# EasyEDA Pro project ProProject_EquiCycle_2024-03-26.epro, board PCB1
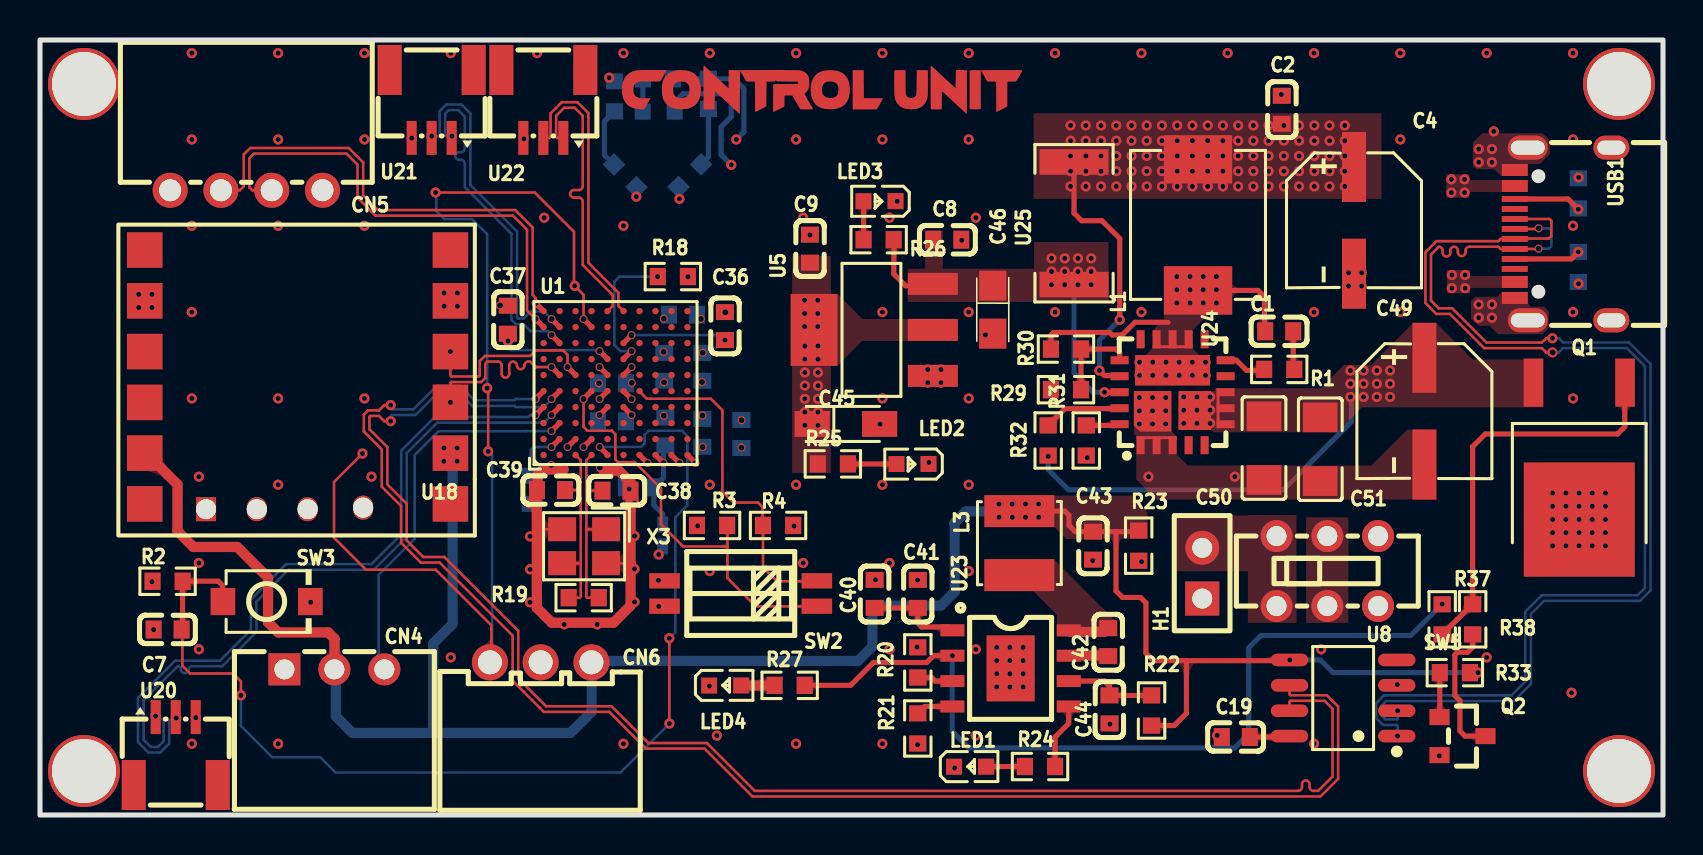
[diagram p1: board, top side]
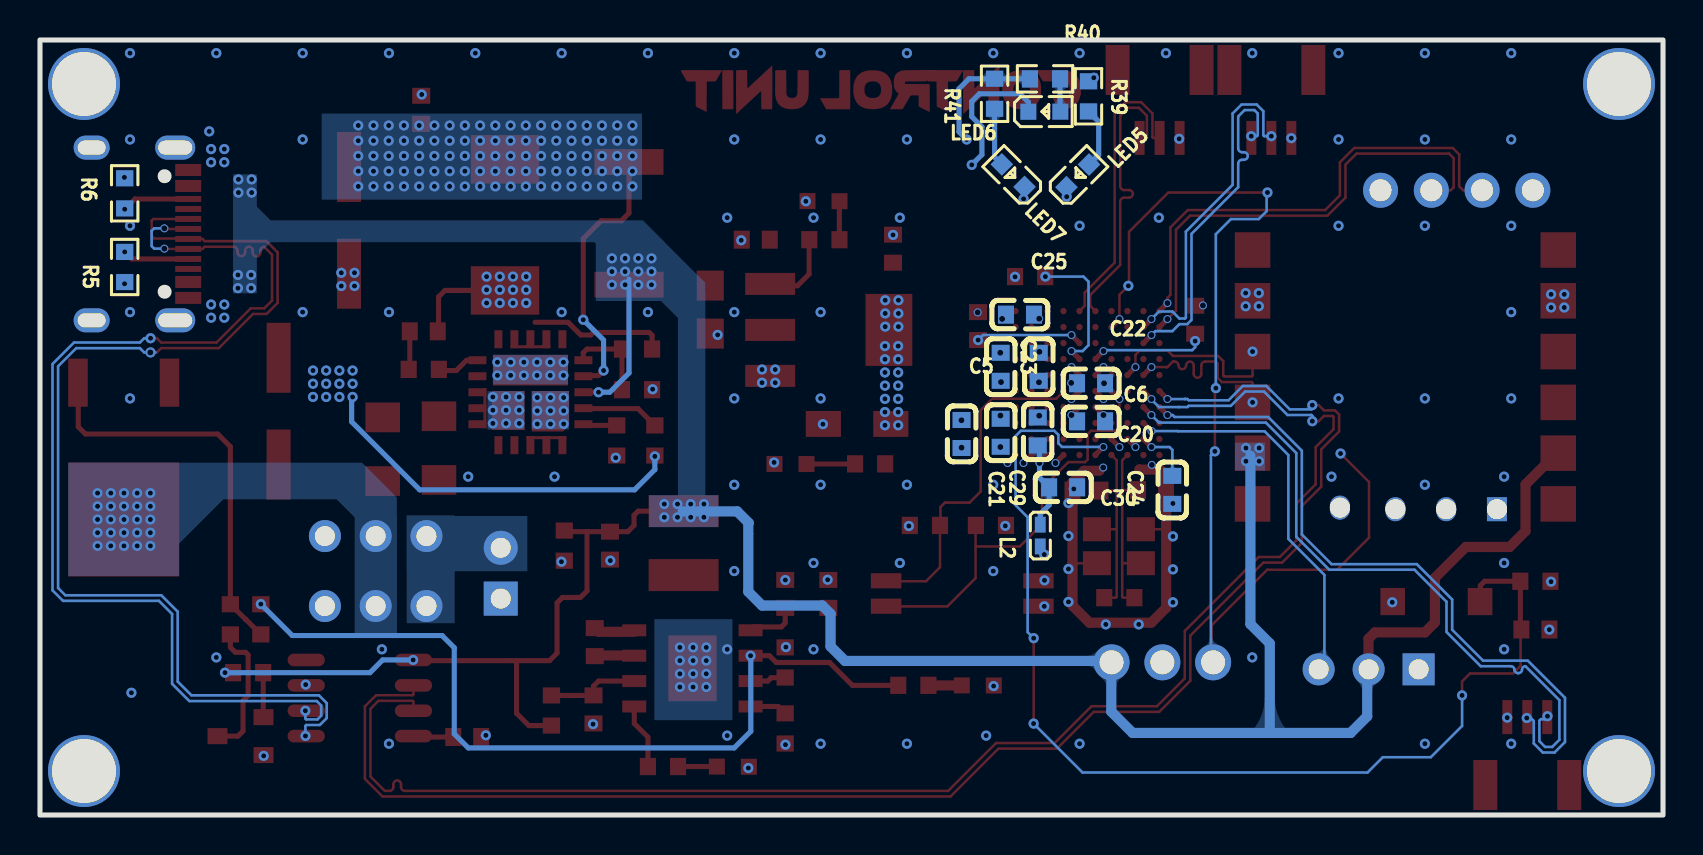
[diagram p2: board, bottom side, seen from below]

Outline 81.18 x 38.77 mm; copper layers: Top Layer, GND1, PWR1, Bottom Layer. Coordinates in mm from the lower left corner of the outline.
Outline path: rectangle 0,38.77 81.18,0
Stack: Top Layer 0.035mm 外层铜厚1oz / Dielectric1 0.28mm 7628 RC49% 8.6mil / GND1 0.035mm 内层铜厚 / Dielectric2 0.28mm 1.1mm H/HOZ 含铜 / PWR1 0.035mm 内层铜厚 / Dielectric3 0.28mm 7628 RC49% 8.6mil / Bottom Layer 0.035mm 外层铜厚1oz

## Design rules (mm)
net OSC_IN: DP1
net USART6_TX: DP7
net USART6_RX: DP7
net OSC_OUT: DP1
net UART4_TX: DP6
net UART4_RX: DP6
net USART1_RX: DP5
net USART1_TX: DP5
net USART2_TX: DP2
net USART2_RX: DP2
net USART3_RX: DP4
net CLK: DP3
net USART3_TX: DP4
net DIO: DP3
net D-: DP8
net D+: DP8
template: 0.8mmBGA
spacing copperThickness1oz (default): track to track 0.102, other pairs 0.102 to 0.3
spacing copperThickness2oz: track to track 0.203, other pairs 0.152 to 0.3
spacing copperThicknessInner0.5oz: track to track 0.089, other pairs 0.152 to 0.3
track width copperThickness1oz (default): min 0.102, default 0.254, max 2.54
track width copperThickness2oz: min 0.203, default 0.254, max 2.54
track width copperThickness0.5oz: min 0.089, default 0.254, max 2.54
differential pair differentialPair (default): width min 0.127, default 0.254, max 2.54; gap min 0.152, default 0.152
via viaSize (default): diameter min 0.3, default 0.399, max 10; hole min 0.201, default 0.3, max 6.299

## Placement (name value [footprint] x y rotation side)
C1  100nF  [C0603]  61.99 24.2 0 top
C2  2.2uF  [C0603]  62.12 35.28 270 top
C4  100uF  [CAP-SMD_BD6.3-L6.6-W6.6-FD]  65.73 29.75 270 top
C5  10uF  [C0603]  35.09 19.06 270 bottom
C6  100nF  [C0603]  28.61 21.6 0 bottom
C7  100nF  [C0603]  6.38 9.28 0 top
C8  100nF  [C0603]  45.38 28.78 180 top
C9  10uF  [C0603]  38.51 28.33 270 top
C19  100nF  [C0603]  59.81 3.9 0 top
C20  100nF  [C0603]  28.61 19.69 0 bottom
C21  100nF  [C0603]  33.13 19.12 270 bottom
C22  100nF  [C0603]  31.22 22.42 270 bottom
C23  10uF  [C0603]  33.13 22.42 270 bottom
C24  10uF  [C0603]  24.54 16.27 90 bottom
C25  10uF  [C0603]  32.16 25.03 180 bottom
C29  10uF  [C0603]  31.28 19.19 90 bottom
C30  100nF  [C0603]  30.01 16.39 0 bottom
C36  2.2uF  [C0603]  34.26 24.46 270 top
C37  2.2uF  [C0603]  23.4 24.77 270 top
C38  12PF  [C0603]  28.84 16.23 180 top
C39  12PF  [C0603]  25.56 16.25 0 top
C40  22uF  [C0603]  41.75 11.06 90 top
C41  22uF  [C0603]  43.91 11.06 90 top
C42  100nF  [C0603]  53.43 8.65 90 top
C43  10uF  [C0603]  52.67 13.47 90 top
C44  10uF  [C0603]  53.5 5.28 90 top
C45  10uF  [CAP-SMD_L3.2-W1.6-RD-C7171]  40.31 19.56 0 top
C46  100nF  [CASE-A_3216]  47.66 25.28 270 top
C49  220uF  [CAP-SMD_BD6.3-L6.6-W6.6-FD]  69.25 20.2 270 top
C50  10uF  [C1206]  61.22 18.35 90 top
C51  10uF  [C1206]  64.04 18.3 90 top
CN4  5264-3AW  [CONN-TH_5264-3AW_C2839672]  14.73 7.29 0 top
CN5  XH-4AW  [CONN-TH_XH-4AW]  10.32 31.25 180 top
CN6  XH-3AW  [CONN-TH_3P-P2.54_HCTL_XH-3AW]  25.04 7.64 180 top
H1  -  [HDR-TH_2P-P2.54-V-F]  58.14 12.1 90 top
L1  6.8uH  [IND-SMD_L7.3-W6.6]  57.92 29.52 90 top
L2  BLM15AG121SN1D  [L0402]  31.15 13.98 90 bottom
L3  2.2uH  [IND-SMD_L4.0-W4.0]  48.99 13.6 90 top
LED1  -  [LED_0603]  46.58 2.43 0 top
LED2  -  [LED_0603]  43.59 17.55 180 top
LED3  -  [LED_0603]  41.94 30.7 180 top
LED4  -  [LED_0603]  34.32 6.49 0 top
LED5  -  [LED_0603]  29.24 32.01 135 bottom
LED6  -  [LED_0603]  30.89 35.19 180 bottom
LED7  -  [LED_0603]  32.55 32.01 45 bottom
NOREF  -  [Pad_e29377]  78.98 2.2 180 top
NOREF#2  -  [Pad_e29376]  78.98 36.57 270 top
NOREF#3  -  [Pad_e29374]  2.2 36.57 0 top
NOREF#4  -  [Pad_e29378]  2.2 2.2 90 top
Q1  IRFR9024NTRPBF  [TO-252-2_L6.6-W6.1-P4.58-LS9.9-TR]  77 18.2 0 top
Q2  -  [S8050_SOT-23]  71.15 4.07 180 top
R1  22R  [R0603]  61.99 22.29 180 top
R2  10K  [R0603]  6.38 11.69 0 top
R3  10K  [R0603]  33.62 14.49 180 top
R4  10K  [R0603]  36.92 14.49 180 top
R5  5.1K  [R0603]  76.95 27.41 90 bottom
R6  5.1K  [R0603]  76.95 31.1 270 bottom
R18  10K  [R0603]  31.66 26.93 0 top
R19  1M  [R0603]  27.2 10.87 180 top
R20  10K  [R0603]  43.91 7.63 270 top
R21  51K  [R0603]  43.91 4.33 90 top
R22  0.5R  [R0603]  55.6 5.23 270 top
R23  5.1K  [R0603]  54.96 13.47 90 top
R24  100R  [R0603]  50.02 2.43 0 top
R25  4.7K  [R0603]  39.66 17.56 0 top
R26  10K  [R0603]  41.95 28.78 180 top
R27  10K  [R0603]  37.5 6.49 180 top
R29  25K  [R0603]  51.32 21.28 0 top
R30  100K  [R0603]  51.32 23.31 0 top
R31  10K  [R0603]  50.43 18.74 270 top
R32  100R  [R0603]  52.34 18.74 90 top
R33  10K  [R0603]  70.77 7.12 180 top
R37  10K  [R0603]  70.14 9.79 90 top
R38  20K  [R0603]  71.66 9.79 270 top
R39  10K  [R0603]  28.74 35.95 90 bottom
R40  10K  [R0603]  30.91 36.82 0 bottom
R41  10K  [R0603]  33.43 36.08 90 bottom
SW2  DSHP02TSGET  [SW-SMD_4P_DSHP02TSGET]  35.05 11.08 90 top
SW3  TS-1088-AR02016  [SW-SMD_L3.9-W3.0-P4.45]  11.34 10.68 0 top
SW5  MSS22D18G2  [SW-TH_MSS22D18GX]  64.39 12.2 180 top
U1  STM32H723VGH6  [TFBGA-100_L8.0-W8.0-R10-C10-P0.80-BL]  28.79 21.61 0 top
U5  AMS1117-3.3  [SOT-223-3_L6.5-W3.4-P2.30-LS7.0-BR]  41.69 24.27 0 top
U8  CH340N  [SOP-8_L4.9-W3.9-P1.27-LS6.0-BL]  65.18 5.85 90 top
U18  -  [YJ62]  21.75 13.98 180 top
U20  ZX-SH1.0-3PWT  [CONN-SMD_3P-P1.00_MEGASTAR_ZX-SH1.0-3PWT]  6.79 3.2 0 top
U21  ZX-SH1.0-3PWT  [CONN-SMD_3P-P1.00_MEGASTAR_ZX-SH1.0-3PWT]  19.59 35.57 180 top
U22  ZX-SH1.0-3PWT  [CONN-SMD_3P-P1.00_MEGASTAR_ZX-SH1.0-3PWT]  25.18 35.57 180 top
U23  IP2325  [ESOP-8_L4.9-W3.9-P1.27-LS6.0-BL-EP]  48.55 7.34 270 top
U24  NDP23A5QB  [QFN-20_L5.0-W5.0-P0.80-TL-NDP1460QB]  56.65 21.15 90 top
U25  1.5mΩ  [R2512]  51.72 29.6 90 top
USB1  KH-TYPE-C-16P-T  [USB-C-SMD_KH-TYPE-C-16P]  76.19 29.07 90 top
X3  25MHz  [CRYSTAL-SMD_4P-L3.2-W2.5-BL]  27.22 13.45 180 top

## Footprints (pads in the part's own frame, mm; a bottom-side part is the same pattern mirrored in y, then rotated)
C0603
  rect 0.8x0.9 smd: 1(-0.7,0) 2(0.7,0)
C1206
  rect 1.485x1.728 smd: 1(-1.593,0) 2(1.593,0)
CAP-SMD_BD6.3-L6.6-W6.6-FD
  rect 3.5x1.2 smd: 1(-2.67,0) 2(2.67,0)
CAP-SMD_L3.2-W1.6-RD-C7171
  rect 1.758x1.296 smd: 1(-1.687,0) 2(1.687,0)
CASE-A_3216
  rect 1.5x1.359 smd: 1(-1.2,0) 2(1.2,0)
CONN-SMD_3P-P1.00_MEGASTAR_ZX-SH1.0-3PWT
  rect 0.5x1.7 smd: 1(-1,1.7) 2(0,1.7) 3(1,1.7)
  rect 1.2x2.5 smd: 4(-2.1,-1.7) 5(2.1,-1.7)
CONN-TH_3P-P2.54_HCTL_XH-3AW
  round 1.8 hole 1.199: 1(-2.54,0) 2(0.002,0) 3(2.54,0)
CONN-TH_5264-3AW_C2839672
  rect 1.6x1.6 hole 1: 1(-2.5,0)
  round 1.6 hole 1: 2(0,0) 3(2.5,0)
CONN-TH_XH-4AW
  round 1.75 hole 1.1: 1(-3.81,0) 2(-1.27,0) 3(1.27,0) 4(3.81,0)
CRYSTAL-SMD_4P-L3.2-W2.5-BL
  rect 1.4x1.2 smd: 1(-1.1,-0.85) 2(1.1,-0.85) 3(1.1,0.85) 4(-1.1,0.85)
ESOP-8_L4.9-W3.9-P1.27-LS6.0-BL-EP
  rect 0.6x1.2 smd: 1(-1.905,-2.909) 2(-0.635,-2.909) 3(0.635,-2.909) 4(1.905,-2.909) 5(1.905,2.909) 6(0.635,2.909) 7(-0.635,2.909) 8(-1.905,2.909)
  rect 3.3x2.4 smd: 9(0,0)
HDR-TH_2P-P2.54-V-F
  rect 1.7x1.7 hole 1: 1(-1.27,0)
  round 1.7 hole 1: 2(1.27,0)
IND-SMD_L4.0-W4.0
  rect 1.6x3.5 smd: 1(-1.6,0) 2(1.6,0)
IND-SMD_L7.3-W6.6
  rect 2.424x3.42 smd: 1(3.278,0) 2(-3.278,0)
L0402
  rect 0.79x0.54 smd: 1(-0.545,0) 2(0.545,0)
LED_0603
  rect 0.8x0.8 smd: 1(-0.851,-0.01) 2(0.75,-0.005)
Pad_e29374
  round 3.6 hole 3.2: 24(0,0)
Pad_e29376
  round 3.6 hole 3.2: 24(0,0)
Pad_e29377
  round 3.6 hole 3.2: 24(0,0)
Pad_e29378
  round 3.6 hole 3.2: 24(0,0)
QFN-20_L5.0-W5.0-P0.80-TL-NDP1460QB
  rect 0.9x0.4 smd: 1(-2.65,1.6) 2(-2.65,0.8) 3(-2.65,0) 4(-2.65,-0.8) 5(-2.65,-1.6) 11(2.65,-1.6) 12(2.65,-0.8) 13(2.65,0) 14(2.65,0.8) 15(2.65,1.6)
  custom 0.15x2 smd: 3(-2.275,0.8) 14(2.275,0)
  rect 0.4x0.9 smd: 6(-1.6,-2.65) 7(-0.8,-2.65) 8(0,-2.65) 9(0.8,-2.65) 10(1.6,-2.65) 16(1.6,2.65) 17(0.8,2.65) 18(0,2.65) 19(-0.8,2.65) 20(-1.6,2.65)
  custom 2x0.15 smd: 8(-0.799,-2.275)
  custom 2.025x1.875 smd: 21(-0.95,1)
  custom 1.95x1.625 smd: 22(-0.912,-1.11)
  custom 1.525x3.75 smd: 23(1.1,0)
R0603
  rect 0.806x0.864 smd: 1(-0.753,0) 2(0.753,0)
R2512
  rect 1.282x3.456 smd: 1(-3.067,0) 2(3.067,0)
S8050_SOT-23
  rect 1x0.8 smd: 1(1.15,-0.823) 2(1.15,1.077) 3(-1.15,0.127)
SOP-8_L4.9-W3.9-P1.27-LS6.0-BL
  oval 0.63x1.865 smd: 1(-1.905,-2.683) 2(-0.635,-2.683) 3(0.635,-2.683) 4(1.905,-2.683) 5(1.905,2.683) 6(0.635,2.683) 7(-0.635,2.683) 8(-1.905,2.683)
SOT-223-3_L6.5-W3.4-P2.30-LS7.0-BR
  rect 2.5x1.1 smd: 1(2.97,-2.3) 2(2.97,0) 3(2.97,2.3)
  rect 2.34x3.6 smd: 4(-2.97,0)
SW-SMD_4P_DSHP02TSGET
  rect 0.762x1.524 smd: 1(-0.635,-3.81) 2(0.635,-3.81) 3(0.635,3.81) 4(-0.635,3.81)
SW-SMD_L3.9-W3.0-P4.45
  rect 1.23x1.36 smd: 1(-2.185,0) 2(2.185,0)
SW-TH_MSS22D18GX
  round 1.6 hole 1: 1(-2.54,1.75) 2(0,1.75) 3(2.54,1.75) 4(-2.54,-1.75) 5(0,-1.75) 6(2.54,-1.75)
TFBGA-100_L8.0-W8.0-R10-C10-P0.80-BL
  round 0.32 smd: A1(-3.6,-3.6) A2(-3.6,-2.8) A3(-3.6,-2) A4(-3.6,-1.2) A5(-3.6,-0.4) A6(-3.6,0.4) A7(-3.6,1.2) A8(-3.6,2) A9(-3.6,2.8) A10(-3.6,3.6) B1(-2.8,-3.6) B2(-2.8,-2.8) B3(-2.8,-2) B4(-2.8,-1.2) B5(-2.8,-0.4) B6(-2.8,0.4) B7(-2.8,1.2) B8(-2.8,2) B9(-2.8,2.8) B10(-2.8,3.6) C1(-2,-3.6) C2(-2,-2.8) C3(-2,-2) C4(-2,-1.2) C5(-2,-0.4) C6(-2,0.4) C7(-2,1.2) C8(-2,2) C9(-2,2.8) C10(-2,3.6) D1(-1.2,-3.6) D2(-1.2,-2.8) D3(-1.2,-2) D4(-1.2,-1.2) D5(-1.2,-0.4) D6(-1.2,0.4) D7(-1.2,1.2) D8(-1.2,2) D9(-1.2,2.8) D10(-1.2,3.6) E1(-0.4,-3.6) E2(-0.4,-2.8) E3(-0.4,-2) E4(-0.4,-1.2) E5(-0.4,-0.4) E6(-0.4,0.4) E7(-0.4,1.2) E8(-0.4,2) E9(-0.4,2.8) E10(-0.4,3.6) F1(0.4,-3.6) F2(0.4,-2.8) F3(0.4,-2) F4(0.4,-1.2) F5(0.4,-0.4) F6(0.4,0.4) F7(0.4,1.2) F8(0.4,2) F9(0.4,2.8) F10(0.4,3.6) G1(1.2,-3.6) G2(1.2,-2.8) G3(1.2,-2) G4(1.2,-1.2) G5(1.2,-0.4) G6(1.2,0.4) G7(1.2,1.2) G8(1.2,2) G9(1.2,2.8) G10(1.2,3.6) H1(2,-3.6) H2(2,-2.8) H3(2,-2) H4(2,-1.2) H5(2,-0.4) H6(2,0.4) H7(2,1.2) H8(2,2) H9(2,2.8) H10(2,3.6) J1(2.8,-3.6) J2(2.8,-2.8) J3(2.8,-2) J4(2.8,-1.2) J5(2.8,-0.4) J6(2.8,0.4) J7(2.8,1.2) J8(2.8,2) J9(2.8,2.8) J10(2.8,3.6) K1(3.6,-3.6) K2(3.6,-2.8) K3(3.6,-2) K4(3.6,-1.2) K5(3.6,-0.4) K6(3.6,0.4) K7(3.6,1.2) K8(3.6,2) K9(3.6,2.8) K10(3.6,3.6)
TO-252-2_L6.6-W6.1-P4.58-LS9.9-TR
  rect 0.979x2.409 smd: 1(2.29,3.424) 3(-2.29,3.424)
  rect 5.548x5.711 smd: 4(0,-3.424)
USB-C-SMD_KH-TYPE-C-16P
  oval 1.2x2 hole 0.7x1.7: 1(-4.32,1.765) 2(4.32,1.765)
  oval 1.2x1.8 hole 0.7x1.4: 3(-4.32,-2.415) 4(4.32,-2.415)
  rect 0.3x1.3 smd: A1(-3.35,2.415) A4(-2.55,2.415) A5(-1.25,2.415) A6(-0.25,2.415) A7(0.25,2.415) A8(1.25,2.415) A9(2.55,2.415) A12(3.35,2.415) B1(3.05,2.415) B4(2.25,2.415) B5(1.75,2.415) B6(0.75,2.415) B7(-0.75,2.415) B8(-1.75,2.415) B9(-2.25,2.415) B12(-3.05,2.415)
YJ62
  oval 1.001x1.199 hole 1.7: 0(5.588,-1.397) 0(8.364,-1.319) 0(10.904,-1.319)
  rect 1.001x1.199 hole 1.7: 0(13.444,-1.319)
  rect 1.778x1.778 smd: 1(1.219,-1.583) 2(1.219,-4.122) 3(1.219,-6.662) 4(1.219,-9.203) 5(1.219,-11.742) 6(1.219,-14.283) 7(16.51,-14.283) 8(16.51,-11.742) 9(16.51,-9.203) 10(16.51,-6.662) 11(16.51,-4.122) 12(16.51,-1.583)

## Nets
As in the schematic.

Pads without a net: NOREF 24; NOREF#2 24; NOREF#3 24; NOREF#4 24; SW5 1 4; U1 A1 A2 A3 A6 A7 A8 B1 B7 B10 C3 C4 C5 C7 C8 C9 C10 D3 D4 D6 D7 D8 D10 E2 E3 E8 E9 F1 F2 F3 F9 G2 G3 G4 G6 G7 G8 G9 G10 H2 H3 H4 H5 H6 H7 H8 H9 H10 J2 J3 J4 J5 J6 J7 J8 J9 J10 K2 K3 K4 K5 K6 K7 K8 K9 K10; U8 4; U18 0 1 6 7 9 10 12; U20 4 5; U21 4 5; U22 4 5; U24 4 5 9 11 15; USB1 A8 B8

## Via types
v1: diameter 0.508, hole 0.254, Top Layer to Bottom Layer, 424 vias
v2: diameter 0.4, hole 0.3, Top Layer to Bottom Layer, 10 vias
v3: diameter 0.399, hole 0.299, Top Layer to Bottom Layer, 40 vias

## Routing (per net, layer and track width the routed paths; a pad name or vN(x,y) marks a point on that pad's centre or on a via; arc(x,y) is an arc through that point)
3V3: length 12.3
  Top Layer w0.254: U1.F4 v3(29.59,20.01) ; U1.F5 v3(29.59,20.81) ; U1.D2 v3(27.19,18.41) ; U1.F6 v3(29.59,22.41) ; U1.K1 v3(32.79,17.61) ; U1.B2 v3(25.59,18.41)
  Bottom Layer w0.127: 24.54,16.87 24.54,16.88 24.54,18.27 24.69,18.41 v3(25.59,18.41)
  Bottom Layer w0.254: v1(34.83,33.79) 35.21,34.17 35.21,36.33 34.71,36.83 R41.2 31.67,36.83 R40.2
  vias: v1(5.6,11.67) v1(7.59,38.11) v1(7.59,33.79) v1(7.59,29.47) v1(7.59,25.16) v1(7.59,20.84) v1(7.59,3.57) v1(11.91,38.11) v1(11.91,33.79) v1(11.91,29.47) v1(11.91,20.84) v1(11.91,16.52) v1(11.91,3.57) v1(16.23,38.11) v1(16.23,33.79) v1(16.23,29.47) v1(16.23,20.84) v1(20.55,38.11) v1(20.55,7.88) v1(24.87,38.11) v1(28.47,36.88) v1(29.18,38.11) v1(29.18,29.47) v1(29.18,3.57) v1(30.95,13.03) v1(30.94,11.74) v1(30.95,10.44) v1(32.41,26.92) v1(33.5,38.11) v1(33.5,16.52) v1(33.5,12.2) v1(37.82,38.11) v1(37.82,33.79) v1(37.82,16.52) v1(37.82,3.57) v1(38.25,25.75) v1(38.25,25.09) v1(38.25,24.43) v1(38.26,23.46) v1(38.26,22.8) v1(38.26,22.14) v1(38.26,21.48) v1(38.26,20.82) v1(38.26,20.16) v1(38.26,19.5) v1(38.91,25.75) v1(38.91,25.09) v1(38.91,24.43) v1(38.92,23.46) v1(38.92,22.8) v1(38.92,22.14) v1(38.92,21.48) v1(38.92,20.82) v1(38.92,20.16) v1(38.92,19.5) v1(42.14,38.11) v1(42.14,33.79) v1(42.14,25.16) v1(42.14,20.84) v1(42.14,16.52) v1(42.14,3.57) v1(46.46,38.11) v1(46.46,33.79) v1(46.46,25.16) v1(46.46,20.84) v1(46.46,16.52) v1(46.46,12.2) v1(50.77,38.11) v1(50.77,25.16) v1(55.09,38.11) v1(55.09,25.16) v1(59.41,38.11) v1(63.73,38.11) v1(63.73,25.16) v1(63.73,3.57) v1(68.05,38.11) v1(68.05,33.79) v1(68.05,25.16) v1(72.36,38.11) v1(72.36,7.88) v1(76.61,6.12) v1(76.68,38.11) v1(76.68,33.79) v1(76.68,29.47) v1(76.68,25.16) v1(76.68,20.84) v2(31.21,21.65) v2(33.11,21.66) v3(29.6,21.62) v3(31.2,24.83) v3(33.15,18.41) v3(35.09,18.38)
+5V: length 123.4
  Top Layer w0.254: 44.55,26.48 43.29,26.48 42.71,27.06 42.71,28.76 42.72,28.76 ; 54.96,14.23 54.9,14.17 53.82,14.17 ; 62.5,7.76 62.46,7.72 57.82,7.72 ; 53.82,14.17 C43.2 51.78,14.17 51.47,14.49 51.47,15 51.26,15.2 L3.2 ; 53.82,14.17 53.82,11.21 54.15,10.88 55.05,10.88 55.32,10.61 55.32,8.1 55.7,7.72 57.81,7.72 ; 57.35,7.72 57.35,5.09 56.73,4.47 R22.2 ; U24.18 v1(53.25,21.15) ; v1(62.52,7.76) U8.5
  Top Layer w0.508: 5.75,17.66 6.88,16.54 6.88,14.2 7.67,13.41 9.86,13.41 11.41,11.87 11.41,9.64 11.91,9.14 14.42,9.14 14.73,8.82 14.73,7.34 14.76,7.32
  Bottom Layer w0.254: v1(71.93,7.12) 64.68,7.12 64.04,7.76 v1(62.52,7.76) ; 51.72,26.81 51.72,22.11 52.68,21.15 v1(53.25,21.15)
  Bottom Layer w0.508: 20.64,17.98 20.64,9.55 19.67,8.58 19.67,4.14 19.66,4.13 ; 27.6,7.57 27.6,5.17 26.53,4.11 15.63,4.11 14.8,4.94 14.8,7.07 ; 49.04,15.19 46.31,15.19 45.74,14.61 45.75,14.59 45.75,11.17 45.06,10.48 42.06,10.48 41.64,10.06 41.64,8.43 40.91,7.71 27.71,7.71
  vias: v1(20.2,18.36) v1(20.2,17.7) v1(20.86,18.36) v1(20.86,17.7) v1(47.98,15.55) v1(47.98,14.89) v1(48.64,15.55) v1(48.64,14.89) v1(49.3,15.55) v1(49.3,14.89) v1(49.96,15.55) v1(49.96,14.89) v1(50.6,27.85) v1(50.6,27.19) v1(50.6,26.52) v1(51.26,27.85) v1(51.26,27.19) v1(51.26,26.52) v1(51.92,27.85) v1(51.92,27.19) v1(51.92,26.52) v1(52.58,27.85) v1(52.58,27.19) v1(52.58,26.52) v1(70.6,31.8) v1(70.6,31.14) v1(70.62,27.02) v1(70.62,26.36) v1(71.26,31.8) v1(71.26,31.14) v1(71.28,27.02) v1(71.28,26.36)
GND: length 34.4
  Top Layer w0.127: 26.11,14.29 24.87,14.29 ; 29.56,12.58 29.55,12.59 28.32,12.59
  Top Layer w0.254: U1.E4 v3(27.99,20.01) ; U1.C2 v3(26.39,18.41) ; U1.E6 v3(27.99,22.41) ; U1.J1 v3(31.99,17.61) ; U1.E5 v3(27.99,20.81) ; U1.G1 v3(30.39,17.61)
  Top Layer w0.508: 28.19,17.22 28.96,17.22 29.55,16.63 29.55,16.24 ; 29.54,16.23 29.54,10.47 28.69,9.62 25.6,9.62 24.85,10.37 24.85,16.28 ; 24.89,16.21 24.89,17.02 25.16,17.28 26.18,17.28 26.19,17.29
  Bottom Layer w0.254: v1(34.58,32.52) 34.07,33.03 34.07,34.43 34.58,34.93 34.58,35.7 34.2,36.08 32.16,36.08 31.75,35.66 LED6.1
  vias: v1(4.94,26.05) v1(4.94,25.39) v1(5.6,26.05) v1(5.6,25.39) v1(5.69,9.27) v1(7.79,4.87) v1(7.95,16.93) v1(7.95,12.61) v1(7.95,8.29) v1(13.54,10.64) v1(16.58,16.93) v1(18.59,33.86) v1(20.22,26.11) v1(20.22,25.45) v1(20.88,26.11) v1(20.88,25.45) v1(24.2,33.83) v1(24.51,15.58) v1(24.51,13.94) v1(24.51,12.29) v1(24.51,10.64) v1(25.22,29.88) v1(26.22,9.54) v1(27.87,9.54) v1(29.47,16.31) v1(29.74,15.61) v1(29.74,13.96) v1(29.74,12.31) v1(29.74,10.66) v1(29.83,30.93) v1(31.99,30.82) v1(32.9,14.46) v1(33.48,6.45) v1(33.86,3.97) v1(37.72,14.46) v1(38.17,29.88) v1(38.17,12.61) v1(38.52,29.02) v1(41.79,11.77) v1(42.02,19.55) v1(42.49,29.88) v1(42.49,12.61) v1(42.49,8.29) v1(42.88,30.7) v1(43.9,11.75) v1(43.87,8.4) v1(43.9,3.52) v1(44.41,22.29) v1(44.41,21.62) v1(44.46,17.64) v1(45.07,22.29) v1(45.07,21.62) v1(45.75,2.35) v1(46.11,28.75) v1(46.81,29.88) v1(46.81,8.29) v1(46.81,3.97) v1(47.29,24.02) v1(47.86,8.38) v1(47.86,7.72) v1(47.86,7.06) v1(47.86,6.4) v1(48.52,8.38) v1(48.52,7.72) v1(48.52,7.06) v1(48.52,6.4) v1(49.18,8.38) v1(49.18,7.72) v1(49.18,7.06) v1(49.18,6.4) v1(50.54,21.3) v1(52.39,17.87) v1(52.66,12.73) v1(53.52,4.55) v1(54.99,20.88) v1(54.99,20.22) v1(54.99,19.56) v1(55.1,12.67) v1(55.45,16.93) v1(55.65,20.88) v1(55.65,20.22) v1(55.65,19.56) v1(56.31,20.88) v1(56.31,20.22) v1(56.31,19.56) v1(58.88,3.99) v1(59.76,16.93) v1(62.09,36.04) v1(64.08,8.29) v1(65.45,27.12) v1(65.45,26.46) v1(66.11,27.12) v1(66.11,26.46) v1(67.89,6.52) v1(70,2.96) v1(71.97,33.31) v1(71.97,32.65) v1(71.97,25.54) v1(71.97,24.88) v1(72.63,33.31) v1(72.63,32.65) v1(72.63,25.54) v1(72.63,24.88) v1(72.72,34.2) v1(76.96,31.9) v1(76.95,26.57) v2(23.01,25.49) v2(27.96,21.6) v2(31.19,23.17) v2(33.06,24.82) v2(33.14,19.98) v2(33.15,23.12) v2(34.28,25.14) v2(35.09,19.75) v3(25.57,17.51) v3(28,17.38) v3(31.2,19.98)
VDDA: length 4.9
  Top Layer w0.254: U1.H1 v3(31.19,17.61)
  Bottom Layer w0.254: C29.1 31.19,18.4 v3(31.19,17.61) 31.19,16.88 C30.2 30.71,15.5 31.15,15.06 L2.2
VIN: length 18.9
  Bottom Layer w0.254: v1(65.55,20.91) 65.6,20.87 65.6,19.67 62.19,16.27 51.44,16.27 50.43,17.28 v1(50.43,17.94)
  vias: v1(57.21,20.91) v1(57.21,20.25) v1(57.21,19.59) v1(57.87,20.91) v1(57.87,20.25) v1(57.87,19.59) v1(58.53,20.91) v1(58.53,20.25) v1(58.53,19.59) v1(65.55,22.23) v1(65.55,21.57) v1(66.21,22.23) v1(66.21,21.57) v1(66.21,20.91) v1(66.87,22.23) v1(66.87,21.57) v1(66.87,20.91) v1(67.53,22.23) v1(67.53,21.57) v1(67.53,20.91)
BAT_7.4V: length 42.2
  Top Layer w0.254: v1(70.14,10.55) R37.2 ; v1(45.64,7.97) 44.7,7.97 44.36,7.63 41.69,7.63 40.55,6.49 R27.1
  Bottom Layer w0.254: v1(45.64,7.97) 45.63,7.96 45.63,4.19 46.46,3.36 59.76,3.36 60.46,4.06 60.46,8.37 61.07,8.98 68.57,8.98 v1(70.14,10.55)
  vias: v1(75.66,16.1) v1(75.66,15.44) v1(75.66,14.78) v1(75.66,14.12) v1(75.66,13.46) v1(76.32,16.1) v1(76.32,15.44) v1(76.32,14.78) v1(76.32,14.12) v1(76.32,13.46) v1(76.98,16.1) v1(76.98,15.44) v1(76.98,14.78) v1(76.98,14.12) v1(76.98,13.46) v1(77.64,16.1) v1(77.64,15.44) v1(77.64,14.78) v1(77.64,14.12) v1(77.64,13.46) v1(78.3,16.1) v1(78.3,15.44) v1(78.3,14.78) v1(78.3,14.12) v1(78.3,13.46)
BOOT0: length 21.2
  Top Layer w0.127: v3(27.19,20.81) 27.19,19.42 27.38,19.22 28.6,19.22 28.78,19.05 28.78,17.78 28.91,17.65 29.75,17.65 31.06,16.34 31.06,14.54 32.17,13.43 34.39,13.43 ; 38.89,10.39 38.85,10.44 35.8,10.44 34.39,11.85 34.39,14.48
  Top Layer w0.254: U1.D5 v3(27.19,20.81)
BOOT1: length 17
  Top Layer w0.127: 36.15,14.46 36.14,14.46 36.14,15.4 35.91,15.63 34.68,15.63 34.13,16.18 34.13,20.25 33.56,20.82 30.35,20.82 29.99,21.19 ; SW2.2 38.84,11.69 36.86,11.69 36.17,12.39 R4.2
CC1: length 3.3
  Top Layer w0.254: v1(76.95,28.17) 76.59,27.82 USB1.A5
CC2: length 3.4
  Top Layer w0.254: v1(76.95,30.3) 76.43,30.82 USB1.B5
CLK: length 24.4
  Top Layer w0.127: v3(24.79,24.81) 24.36,25.23 24.36,29.28 23.66,29.98 16.78,29.98 15.88,30.88 15.88,32.53 15.33,33.09 10.7,33.09 10.47,32.86 10.47,31.4 10.62,31.25 CN5.2
  Top Layer w0.254: U1.A9 v3(24.79,24.81)
D+: length 56.1
  Top Layer w0.127: USB1.A6 73.79,28.84 73.9,28.84 ; USB1.A6 73.06,28.82 72.95,28.71 69.86,28.71 69.3,28.15 69.3,25.62 69.85,25.07 70.53,25.07 72.24,23.36 75.12,23.36 75.34,23.14 v1(75.65,23.14) v3(75.67,23.14) ; USB1.A6 73.9,28.84 ; 73.9,28.84 75.47,28.84 75.6,28.97 75.6,29.73 75.51,29.82 USB1.B6
  Bottom Layer w0.127: 75.41,23.14 v1(75.65,23.14) 75.97,23.14 76.19,23.36 79.37,23.36 80.28,22.44 80.28,11.36 79.91,10.99 75.12,10.99 74.3,10.17 74.3,6.68 73.61,5.99 67.23,5.99 66.84,5.6 66.84,4.85 67.19,4.5 67.86,4.5 67.91,4.46 67.91,3.96 v1(67.91,3.96)
D-: length 56.1
  Top Layer w0.127: v1(75.65,23.85) 75.34,23.85 75.12,23.64 72.35,23.64 70.64,25.34 69.96,25.34 69.58,25.73 69.58,28.03 69.97,28.43 arc(70.11,28.37) 70.16,28.24 70.16,28.13 arc(70.35,27.94) 70.54,28.13 70.54,28.24 arc(70.73,28.43) 70.92,28.24 70.92,28.15 arc(71.12,27.96) 71.31,28.15 71.31,28.24 arc(71.36,28.37) 71.5,28.43 72.95,28.43 73.06,28.32 USB1.B7 74.95,28.32 v3(74.96,28.33) ; v3(74.96,29.35) 74.93,29.32 USB1.A7
  Bottom Layer w0.127: v1(67.91,5.22) 67.91,4.83 67.87,4.78 67.3,4.78 67.12,4.97 67.12,5.48 67.34,5.7 73.72,5.7 74.57,6.56 74.57,10.06 75.23,10.71 80.03,10.71 80.56,11.24 80.56,22.56 79.48,23.64 76.19,23.64 75.97,23.85 v1(75.65,23.85) 75.66,23.86 75.53,23.86 ; v3(74.96,29.35) 75.47,29.35 75.6,29.22 75.6,28.46 75.47,28.33 v3(74.96,28.33)
DIO: length 24.4
  Top Layer w0.127: CN5.3 10,31.25 10.19,31.45 10.19,33.04 10.52,33.37 15.45,33.37 16.16,32.65 16.16,31 16.9,30.26 23.77,30.26 24.64,29.39 24.64,26.02 24.79,25.87 v3(24.79,25.61)
  Top Layer w0.254: U1.A10 v3(24.79,25.61)
NRST: length 56.5
  Top Layer w0.127: v1(31.48,8.84) 31.48,4.58 v1(31.48,4.58) ; v1(10.05,5.98) 10.05,6.68 9.66,7.08 7.51,7.08 7.12,7.46 7.12,9.19 7.11,9.2
  Top Layer w0.254: 9.18,10.54 9.14,10.59 9.14,11.48 8.92,11.7 7.13,11.7 7.13,9.42 7.04,9.32 ; 28,18.42 28.4,18.02
  Bottom Layer w0.127: v1(10.05,5.98) 10.05,4.45 11.61,2.89 14.02,2.89 14.78,2.13 29.03,2.13 v1(31.48,4.58) ; v1(31.48,8.84) 31.78,9.15 31.78,14.89 32.38,15.5 32.38,18.96 32.12,19.22 30.45,19.22 30.25,19.02 30.25,18.6 30.06,18.41 v3(28,18.41)
OSC_IN: length 9.6
  Top Layer w0.127: 27.05,16.26 27.05,17.75 U1.C1 ; 27.05,16.26 27.05,10.92 27,10.87 R19.2 ; 27.05,16.26 27.04,16.25 C39.2 ; 27.05,12.59 27.04,12.59 X3.3
OSC_OUT: length 9.6
  Top Layer w0.127: 27.33,14.31 27.35,14.3 X3.1 ; 27.33,14.31 27.33,16.23 ; 27.33,14.31 27.33,10.92 27.37,10.87 R19.1 ; 27.33,16.23 27.33,17.75 U1.D1 ; 27.33,16.23 C38.2
PWM: length 54.6
  Top Layer w0.127: v1(16.13,18.08) 14.71,16.66 14.71,13.87 16.31,12.27 19.8,12.27 22.58,9.49 22.58,7.56 ; v1(19.79,31.14) 24.75,31.14 26.71,29.17 26.71,26.5 v1(26.74,26.47) 27.19,26.03 v3(27.19,24.81) ; v1(22.37,21.35) 22.42,21.3 v1(22.42,18.19)
  Top Layer w0.254: U1.D9 v3(27.19,24.81)
  Bottom Layer w0.127: v1(22.37,21.35) 22.37,29.05 21.61,29.81 20.22,29.81 19.83,30.21 19.83,31.1 v1(19.79,31.14) ; 22.61,7.8 22.61,18 v1(22.42,18.19)
UART4_RX: length 35.4
  Top Layer w0.254: U1.B4 v3(25.59,20.01)
  Bottom Layer w0.127: v3(25.59,20.01) 25.21,19.63 19.87,19.63 18.34,18.11 18.34,13.92 16.69,12.27 12.43,12.27 10.83,10.67 10.83,9.15 9.12,7.44 7.61,7.44 arc(7.48,7.39) 7.43,7.27 arc(7.38,7.15) 7.26,7.1 7.22,7.1 arc(7.1,7.15) 7.05,7.27 arc(7,7.39) 6.88,7.44 5.18,5.75 5.18,3.77 5.54,3.4 5.89,3.4 6.19,3.7 6.19,4.72 6.11,4.79 5.93,4.79 v1(5.78,4.94)
UART4_TX: length 35.4
  Top Layer w0.254: U1.A4 v3(24.79,20.01)
  Bottom Layer w0.127: v3(24.79,20.01) 24.53,20.01 24.43,19.91 19.75,19.91 18.07,18.22 18.07,14.04 16.58,12.55 12.31,12.55 10.55,10.78 10.55,9.27 9,7.72 6.76,7.72 4.9,5.86 4.9,3.65 5.43,3.13 6.01,3.13 6.46,3.58 6.46,4.71 6.61,4.85 6.79,4.85 6.82,4.82
  vias: v1(6.82,4.85)
USART1_RX: length 78.1
  Top Layer w0.127: U8.6 62.5,6.04 62.55,5.99 64.37,5.99 64.93,5.43 64.93,1.81 64.05,0.93 35.64,0.93 33.24,3.32 30.31,3.32 28.47,5.16 25.2,5.16 23.64,6.72 23.64,8.97 19.99,12.63 19.05,12.63 18.06,13.62 18.06,15.46 17.1,16.42 17.1,18.29 16.2,19.18 16.2,20.03 16.41,20.24 16.96,20.24 17.22,20.5 v1(17.54,20.5)
  Top Layer w0.254: U1.A5 v3(24.79,20.81)
  Bottom Layer w0.127: v1(17.54,20.5) 17.54,20.34 17.59,20.29 18.67,20.29 19.84,21.46 21.02,21.46 21.73,20.75 23.72,20.75 23.78,20.81 23.91,20.81 ; v3(24.79,20.81) 23.91,20.81 ; 23.91,20.81 23.9,20.82
USART1_TX: length 78.1
  Top Layer w0.127: v1(17.54,19.7) 17.22,19.7 16.96,19.96 16.52,19.96 16.48,19.92 16.48,19.3 17.38,18.4 17.38,16.54 18.34,15.57 18.34,13.73 19.17,12.91 20.23,12.91 23.92,9.21 23.92,6.83 25.32,5.44 28.59,5.44 30.43,3.6 33.36,3.6 35.75,1.21 62.93,1.21 arc(63.07,1.26) 63.12,1.4 63.12,1.54 arc(63.31,1.73) 63.51,1.54 63.51,1.4 arc(63.56,1.26) 63.7,1.21 63.94,1.21 64.65,1.93 64.65,5.31 64.26,5.71 62.55,5.71 62.5,5.67 U8.7
  Top Layer w0.254: U1.B5 v3(25.59,20.81)
  Bottom Layer w0.127: v3(25.59,20.81) 25.59,20.79 25.21,20.41 24.23,20.41 24.23,20.41 23.78,20.41 23.72,20.47 21.62,20.47 20.9,21.18 19.96,21.18 18.78,20.01 17.59,20.01 17.54,19.97 v1(17.54,19.7)
USART2_RX: length 9.3
  Top Layer w0.127: v1(20.53,23.18) 20.53,21.98 20.58,21.94 21.95,21.94 22,21.98 22,22.71 22.25,22.96 24.51,22.96 24.79,23.24 26.17,23.24 26.39,23.02 v3(26.39,22.41)
  Top Layer w0.254: U1.C6 v3(26.39,22.41)
USART2_TX: length 9.3
  Top Layer w0.127: v1(20.53,20.64) 20.53,21.61 20.58,21.66 22.07,21.66 22.28,21.87 22.28,22.59 22.37,22.68 22.9,22.68 arc(23.04,22.63) 23.09,22.49 23.09,22.07 arc(23.28,21.87) 23.47,22.07 23.47,22.49 arc(23.66,22.68) 23.86,22.49 ; 24.85,22.41 24.79,22.41 24.51,22.68 24.43,22.68 arc(24.29,22.63) 24.24,22.49 ; 24.85,22.41 24.84,22.41 ; 24.85,22.41 v3(25.59,22.41) ; 23.86,22.49 arc(24.05,22.3) 24.24,22.49
  Top Layer w0.254: U1.B6 v3(25.59,22.41)
USART3_RX: length 17.3
  Top Layer w0.254: U1.B8 v3(25.59,24.01)
  Bottom Layer w0.127: v1(20.6,33.96) 20.32,33.96 20.27,34 20.27,35.09 20.44,35.26 20.93,35.26 21.25,34.94 21.25,33.35 arc(21.19,33.21) 21.06,33.16 20.96,33.16 arc(20.77,32.97) 20.96,32.78 21.06,32.78 arc(21.19,32.72) 21.25,32.59 21.25,31.4 23.59,29.07 23.59,24.76 23.79,24.56 24.19,24.56 24.54,24.21 25.39,24.21 v3(25.59,24.01)
USART3_TX: length 17.3
  Top Layer w0.254: U1.B9 v3(25.59,24.81)
  Bottom Layer w0.127: v3(25.59,24.81) 25.21,25.18 24.54,25.18 24.19,24.84 23.91,24.84 23.87,24.88 23.87,29.18 21.53,31.52 21.53,35.09 21.08,35.54 20.33,35.54 19.99,35.21 19.99,34 19.95,33.96 v1(19.59,33.96)
USART6_RX: length 14.5
  Top Layer w0.127: U1.E10 28.65,25.47 28.65,26.01 27.15,27.51 27.15,30.69 arc(27.09,30.83) 26.96,30.88 26.71,30.88 arc(26.52,31.07) 26.71,31.26 26.96,31.26 arc(27.09,31.32) 27.15,31.45 27.15,34.98 26.75,35.38 26.21,35.38 25.82,34.98 25.82,33.91 25.86,33.87 U22.1
USART6_TX: length 14.5
  Top Layer w0.127: U1.F10 28.93,25.47 28.93,26.13 27.43,27.63 27.43,35.11 26.89,35.66 26.1,35.66 25.54,35.1 25.54,33.91 25.49,33.87 U22.2
USART10_TX: length 19.4
  Top Layer w0.254: U1.B3 v3(25.59,19.21)
  Bottom Layer w0.127: v3(25.59,19.21) 24.27,19.21 24.26,19.2 19.93,19.2 18.74,18.01 18.74,13.81 16.94,12.01 16.94,7.73 17.29,7.38
$1N11717: length 5.3
  Top Layer w0.254: U1.F8 v3(29.59,24.01)
  Bottom Layer w0.127: v1(34.26,23.76) 34.01,24.01 v3(29.59,24.01)
$1N11758: length 5.5
  Top Layer w0.254: U1.E7 v3(27.99,23.21)
  Bottom Layer w0.127: v3(27.99,23.21) 27.94,23.25 23.55,23.25 23.4,23.4 v1(23.4,23.71)
$1N11785: length 7
  Top Layer w0.254: U1.F7 v3(29.59,23.21)
  Bottom Layer w0.127: v3(29.59,23.21) 29.03,23.21 28.74,23.5 28.74,26.68 28.99,26.93 v1(30.89,26.93)
$1N17298: length 2
  Top Layer w0.254: U8.8 62.46,3.9 C19.2
$1N37765: length 4.8
  Top Layer w0.254: 45.64,9.24 45.47,9.41 44.1,9.41 43.91,9.6 C41.1 C40.1
$1N37977: length 1.8
  Top Layer w0.254: R20.2 43.92,6.87 44.61,6.87 44.78,6.7 45.64,6.7
$1N38061: length 1.9
  Top Layer w0.254: 43.91,5.08 44.25,5.43 45.64,5.43
$1N38254: length 1.7
  Top Layer w0.508: 53.45,7.81 53.28,7.98 51.79,7.98
$1N38282: length 2.1
  Top Layer w0.508: 53.46,9.4 53.22,9.16 51.49,9.16
$1N38371: length 4.7
  Top Layer w0.254: R22.1 C44.2 53.5,6.45 53.25,6.7 U23.6
$1N38697: length 3.3
  Top Layer w0.254: U23.5 51.46,4.58 50.78,3.9 R24.2
$1N38723: length 1.9
  Top Layer w0.254: R24.1 47.33,2.43 47.32,2.42
$1N38898: length 2.5
  Top Layer w0.254: 42.87,17.59 42.83,17.56 40.38,17.56
$1N38997: length 1.9
  Top Layer w0.254: 41.18,30.67 41.2,30.64 41.2,28.77
$1N39024: length 1.7
  Top Layer w0.508: R27.2 36.74,6.48 LED4.2
$1N46795: length 2.2
  Top Layer w0.254: U24.10 59.84,22.75 60.36,22.23 61.18,22.23 R1.2
$1N46796: length 1.9
  Top Layer w0.254: 62.69,24.2 62.69,22.34 R1.1
$1N46798: length 4.4
  Top Layer w0.254: U24.16 54.01,22.75 54.01,23.12 53.82,23.31 R30.2 R29.2
$1N46801: length 13.5
  Top Layer w0.254: U24.17 53.97,21.98 53.25,21.98 v1(52.99,22.23) ; U25.2 51.72,30.11 52.1,29.73 53.12,29.73 54.01,28.84 v1(54.01,24.77)
  Bottom Layer w0.254: v1(52.99,22.23) 52.99,23.76 v1(54.01,24.77)
  vias: v1(51.55,34.49) v1(51.55,33.73) v1(51.55,32.97) v1(51.55,32.21) v1(51.55,31.44) v1(52.31,34.49) v1(52.31,33.73) v1(52.31,32.97) v1(52.31,32.21) v1(52.31,31.44) v1(53.07,34.49) v1(53.07,33.73) v1(53.07,32.97) v1(53.07,32.21) v1(53.07,31.44) v1(53.84,34.49) v1(53.84,33.73) v1(53.84,32.97) v1(53.84,32.21) v1(53.84,31.44) v1(54.6,34.49) v1(54.6,33.73) v1(54.6,32.97) v1(54.6,32.21) v1(54.6,31.44) v1(55.36,34.49) v1(55.36,33.73) v1(55.36,32.97) v1(55.36,32.21) v1(55.36,31.44) v1(56.12,34.49) v1(56.12,33.73) v1(56.12,32.97) v1(56.12,32.21) v1(56.12,31.44) v1(56.88,34.49) v1(56.88,33.73) v1(56.88,32.97) v1(56.88,32.21) v1(56.88,31.44) v1(57.65,34.49) v1(57.65,33.73) v1(57.65,32.97) v1(57.65,32.21) v1(57.65,31.44) v1(58.41,34.49) v1(58.41,33.73) v1(58.41,32.97) v1(58.41,32.21) v1(58.41,31.44) v1(59.17,34.49) v1(59.17,33.73) v1(59.17,32.97) v1(59.17,32.21) v1(59.17,31.44) v1(59.93,34.49) v1(59.93,33.73) v1(59.93,32.97) v1(59.93,32.21) v1(59.93,31.44) v1(60.69,34.49) v1(60.69,33.73) v1(60.69,32.97) v1(60.69,32.21) v1(60.69,31.44) v1(61.46,34.49) v1(61.46,33.73) v1(61.46,32.97) v1(61.46,32.21) v1(61.46,31.44) v1(62.22,34.49) v1(62.22,33.73) v1(62.22,32.97) v1(62.22,32.21) v1(62.22,31.44) v1(62.98,34.49) v1(62.98,33.73) v1(62.98,32.97) v1(62.98,32.21) v1(62.98,31.44) v1(63.74,34.49) v1(63.74,33.73) v1(63.74,32.97) v1(63.74,32.21) v1(63.74,31.44) v1(64.5,34.49) v1(64.5,33.73) v1(64.5,32.97) v1(64.5,32.21) v1(64.5,31.44) v1(65.27,34.49) v1(65.27,33.73) v1(65.27,32.97) v1(65.27,32.21) v1(65.27,31.44)
$1N46802: length 3.9
  Top Layer w0.254: R31.1 51.27,20.33 53.98,20.33 U24.19
$1N46804: length 1.7
  Top Layer w0.254: R32.2 53.94,19.49 U24.20
$1N46808: length 12.1
  Top Layer w0.254: 56.42,24.65 54.77,24.65 54.14,24.01 53.63,24.01 53.5,24.14 50.71,24.14 50.57,24 R30.1 ; L1.2 60.92,26.24 61.25,25.92 61.25,24.24 C1.1
  vias: v1(55,22.65) v1(55,21.99) v1(55.66,22.65) v1(55.66,21.99) v1(56.32,22.65) v1(56.32,21.99) v1(56.86,26.93) v1(56.86,26.27) v1(56.86,25.61) v1(56.98,22.65) v1(56.98,21.99) v1(57.53,26.93) v1(57.53,26.27) v1(57.53,25.61) v1(57.64,22.65) v1(57.64,21.99) v1(58.19,26.93) v1(58.19,26.27) v1(58.19,25.61) v1(58.3,22.65) v1(58.3,21.99) v1(58.85,26.93) v1(58.85,26.27) v1(58.85,25.61)
$1N47261: length 2.2
  Top Layer w0.254: Q2.1 70.02,4.91 R33.2
$1N52209: length 20.3
  Top Layer w0.254: R37.1 70.89,9.79 70.9,9.79 71.65,10.54 R38.1 71.66,18.43 72.29,19.06 78.91,19.06 79.27,19.42 79.27,21.59 79.3,21.62
$1N52301: length 7
  Top Layer w0.254: R38.2 71.66,8.39 71.41,8.14 70.9,8.14 70.77,8.01 70.77,5.98 71.03,5.72 71.03,4.2 71.28,3.95 Q2.3
$1N61169: length 3.1
  Bottom Layer w0.254: 28.71,32.54 28.23,33.02 28.23,34.69 R39.1
$1N61471: length 1.6
  Bottom Layer w0.254: LED6.2 30.16,35.2 R40.1
$1N61551: length 2.9
  Bottom Layer w0.254: LED7.2 33.43,32.91 33.43,35.32

## Copper pours and planes (outline as drawn; the poured copper is in the pictures)
3V3 on Top Layer: 37.56,26.06 45.91,26.06 45.91,22.47 37.56,22.47
3V3 on Top Layer: 37.62,27.97 39.56,27.97 39.56,17.11 37.62,17.11
3V3 on PWR1: -0.76,39.37 87.31,39.37 87.31,-0.81 -0.76,-0.81
+5V on Top Layer: 47.25,16.01 55.4,16.01 55.4,13.81 47.25,13.81
+5V on Top Layer: 70.34,32.05 71.5,32.05 71.5,30.88 70.34,30.88
+5V on Top Layer: 49.73,28.66 53.45,28.66 53.45,25.7 49.73,25.7
+5V on Top Layer: 44.28,29.23 45.16,29.23 45.16,26.66 44.28,26.66
+5V on Top Layer: 43.41,27.33 53.45,27.33 53.45,25.66 43.41,25.66
+5V on Top Layer: 70.37,27.27 71.53,27.27 71.53,26.1 70.37,26.1
+5V on Top Layer: 70.61,26.96 74.42,26.96 74.42,26.37 70.61,26.37
+5V on Top Layer: 70.61,31.76 74.42,31.76 74.42,31.17 70.61,31.17
+5V on Bottom Layer: 19.91,18.64 21.39,18.64 21.39,17.23 19.91,17.23
+5V on Bottom Layer: 47.25,16 50.73,16 50.73,14.4 47.25,14.4
+5V on Bottom Layer: 47.91,26.12 49.27,26.12 49.27,15.63 47.91,15.63
+5V on Bottom Layer: 47.91,28.64 50.31,28.64 50.31,25.71 47.91,25.71
+5V on Bottom Layer: 70.34,32.05 71.53,32.05 71.53,26.1 70.34,26.1
+5V on Bottom Layer: 48.85,26.23 50.37,26.23 50.37,24.85 48.85,24.85
+5V on Bottom Layer: 49.95,30.47 71.17,30.47 71.17,25.71 49.95,25.71
GND on Top Layer: 54.84,19.27 69.84,19.27 69.84,15.78 54.84,15.78
GND on Top Layer: 54.72,21.21 56.85,21.21 56.85,18.05 54.72,18.05
GND on Top Layer: 71.57,26.17 75.47,26.17 75.47,24.05 71.57,24.05
GND on Top Layer: 71.68,34.1 75.53,34.1 75.53,31.97 71.68,31.97
GND on Bottom Layer: 46.55,9.79 50.45,9.79 50.45,4.75 46.55,4.75
GND on Bottom Layer: 54.72,21.21 56.59,21.21 56.59,19.28 54.72,19.28
GND on GND1: -0.52,39.01 86.75,39.01 86.75,-0.5 -0.52,-0.5
VIN on Top Layer: 56.94,24.62 75.19,24.62 75.19,19.15 56.94,19.15
VIN on Bottom Layer: 56.95,21.2 58.8,21.2 58.8,19.28 56.95,19.28
BAT_7.4V on Top Layer: 63.33,14.9 65.44,14.9 65.44,9.61 63.33,9.61
BAT_7.4V on Bottom Layer: 63.33,14.89 65.44,14.89 65.44,8.86 63.33,8.86
BAT_7.4V on Bottom Layer: 63.33,17.63 79.78,17.63 79.78,11.94 63.33,11.94
BAT_IN on Top Layer: 56.86,14.99 62.84,14.99 62.84,12.2 56.86,12.2
BAT_IN on Top Layer: 60.42,15.01 62.85,15.01 62.85,9.61 60.42,9.61
BAT_IN on Bottom Layer: 56.81,14.96 62.84,14.96 62.84,12.2 56.81,12.2
BAT_IN on Bottom Layer: 60.44,14.99 62.84,14.99 62.84,9.6 60.44,9.6
$1N38282 on Top Layer: 50.87,11.45 53.76,11.45 53.76,8.94 50.87,8.94
$1N38282 on Top Layer: 47.27,12.79 52.05,12.79 52.05,8.94 47.27,8.94
$1N46801 on Top Layer: 49.7,35.11 67.1,35.11 67.1,30.82 49.7,30.82
$1N46801 on Bottom Layer: 51.07,35.09 67.09,35.09 67.09,30.78 51.07,30.78
$1N46808 on Top Layer: 55.66,27.45 59.62,27.45 59.62,23.35 55.66,23.35
$1N46808 on Top Layer: 54.78,24.25 58.52,24.25 58.52,21.48 54.78,21.48
$1N46808 on Bottom Layer: 54.77,23.03 58.53,23.03 58.53,21.55 54.77,21.55

Small or netless copper shapes (teardrops, artwork), in the pictures only: 194 on Top Layer, 72 on Bottom Layer
